# EAGLE design quadcopter (EAGLE 6.5.0)
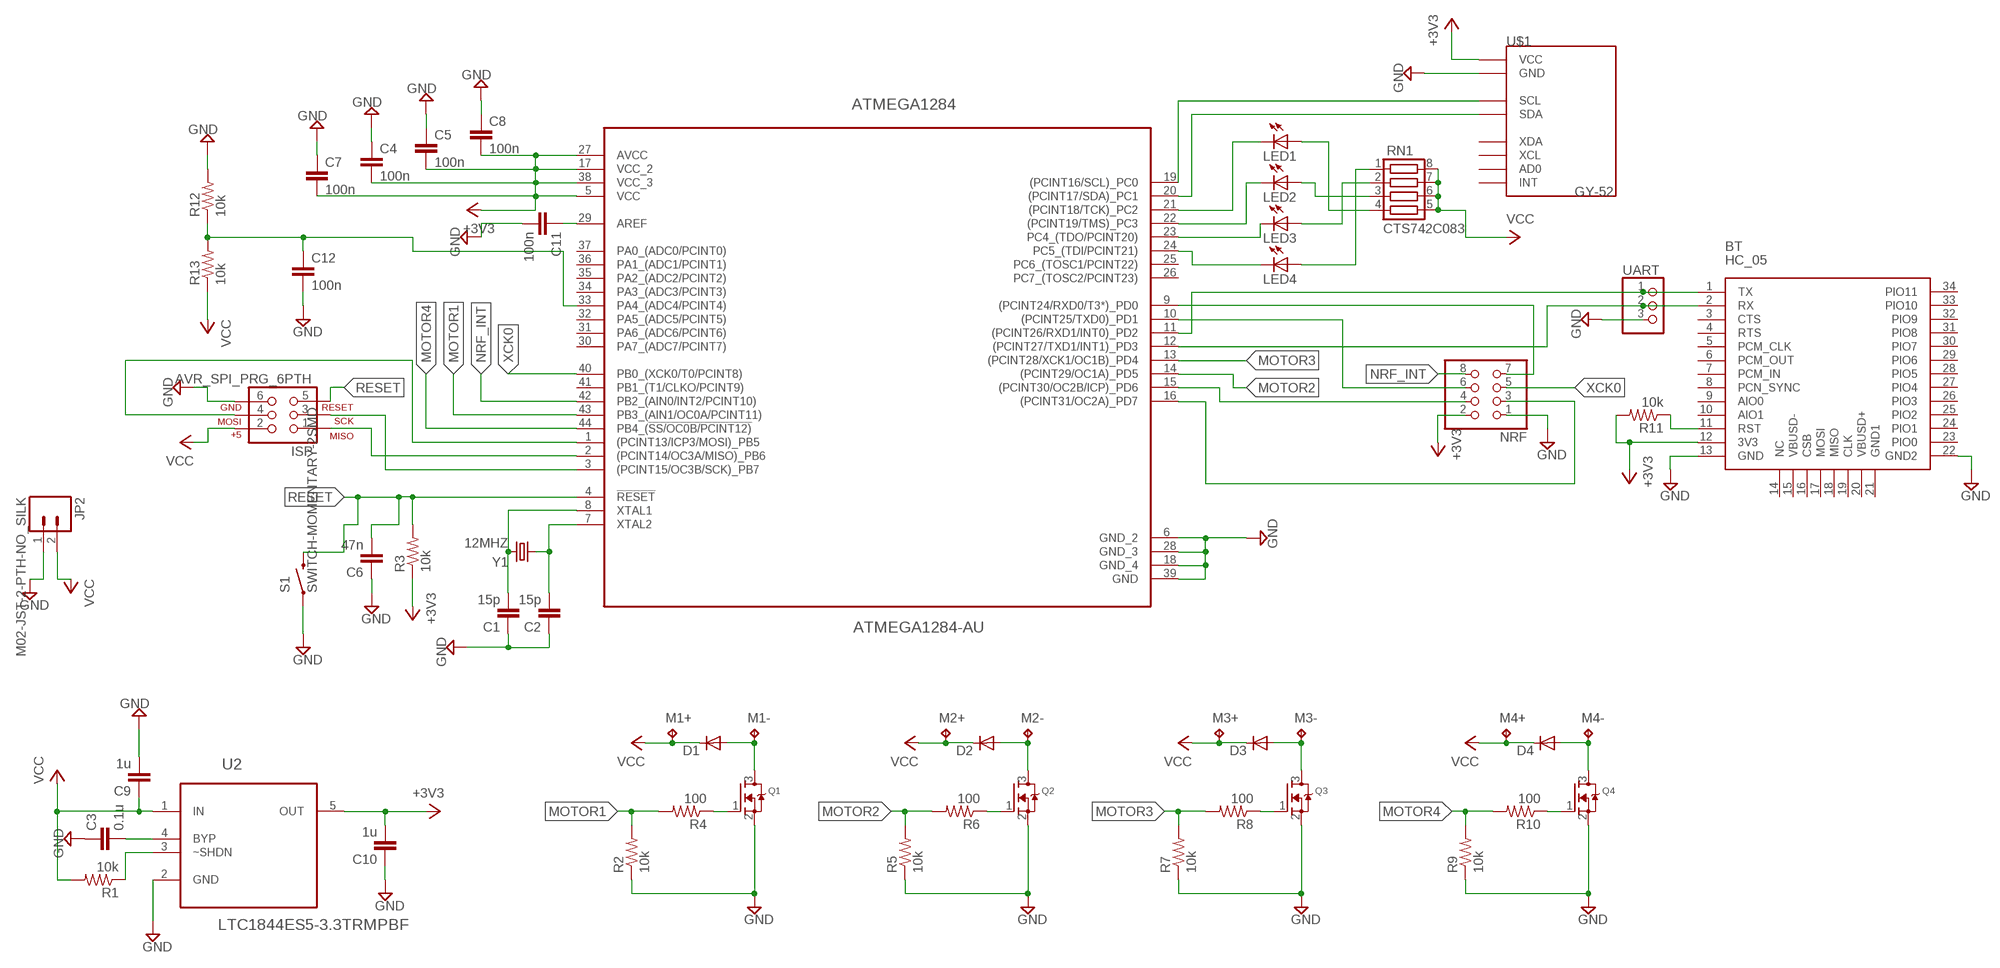
[diagram p0: schematic, sheet 1]

## Parts
ATMEGA1284  ATMEGA1284-AU  [QFP80P1200X1200X120-44N]
BT  HC_05  [BLUETOOTH_SMD]
C1  15p  10UF-6.3V-20%(0603)  [0603-CAP]
C2  15p  10UF-6.3V-20%(0603)  [0603-CAP]
C3  0.1u  10UF-6.3V-20%(0603)  [0603-CAP]
C4  100n  10UF-6.3V-20%(0603)  [0603-CAP]
C5  100n  10UF-6.3V-20%(0603)  [0603-CAP]
C6  47n  10UF-6.3V-20%(0603)  [0603-CAP]
C7  100n  10UF-6.3V-20%(0603)  [0603-CAP]
C8  100n  10UF-6.3V-20%(0603)  [0603-CAP]
C9  1u  10UF-6.3V-20%(0603)  [0603-CAP]
C10  1u  10UF-6.3V-20%(0603)  [0603-CAP]
C11  100n  10UF-6.3V-20%(0603)  [0603-CAP]
C12  100n  10UF-6.3V-20%(0603)  [0603-CAP]
D1  DIODE-SMB  [SMB]
D2  DIODE-SMB  [SMB]
D3  DIODE-SMB  [SMB]
D4  DIODE-SMB  [SMB]
ISP  AVR_SPI_PRG_6PTH  [2X3]
JP2  M02-JST-2-PTH-NO_SILK  [JST-2-PTH-NS]
LED1  LEDCHIP-LED0805  [CHIP-LED0805]
LED2  LEDCHIP-LED0805  [CHIP-LED0805]
LED3  LEDCHIP-LED0805  [CHIP-LED0805]
LED4  LEDCHIP-LED0805  [CHIP-LED0805]
M1+  TPTP20SQ  [TP20SQ]
M1-  TPTP20SQ  [TP20SQ]
M2+  TPTP20SQ  [TP20SQ]
M2-  TPTP20SQ  [TP20SQ]
M3+  TPTP20SQ  [TP20SQ]
M3-  TPTP20SQ  [TP20SQ]
M4+  TPTP20SQ  [TP20SQ]
M4-  TPTP20SQ  [TP20SQ]
NRF  PINHD-2X4  [2X04]
Q1  MOSFET-NREFLOW  [SOT23]
Q2  MOSFET-NREFLOW  [SOT23]
Q3  MOSFET-NREFLOW  [SOT23]
Q4  MOSFET-NREFLOW  [SOT23]
R1  10k  2.0KOHM1/10W5%(0603)  [0603-RES]
R2  10k  2.0KOHM1/10W5%(0603)  [0603-RES]
R3  10k  2.0KOHM1/10W5%(0603)  [0603-RES]
R4  100  2.0KOHM1/10W5%(0603)  [0603-RES]
R5  10k  2.0KOHM1/10W5%(0603)  [0603-RES]
R6  100  2.0KOHM1/10W5%(0603)  [0603-RES]
R7  10k  2.0KOHM1/10W5%(0603)  [0603-RES]
R8  100  2.0KOHM1/10W5%(0603)  [0603-RES]
R9  10k  2.0KOHM1/10W5%(0603)  [0603-RES]
R10  100  2.0KOHM1/10W5%(0603)  [0603-RES]
R11  10k  2.0KOHM1/10W5%(0603)  [0603-RES]
R12  10k  2.0KOHM1/10W5%(0603)  [0603-RES]
R13  10k  2.0KOHM1/10W5%(0603)  [0603-RES]
RN1  CTS742C083  [CTS742C083]
S1  SWITCH-MOMENTARY-2SMD  [TACTILE_SWITCH_SMD]
U2  LTC1844ES5-3.3TRMPBF  [SOT95P280X100-5N]
U$1  GY-52  [PDIP-8]
UART  PINHD-1X3  [1X03]
Y1  12MHZ  CRYSTAL  [TXC-SMD-CRYSTAL]

## Nets
+3V3: ATMEGA1284.5(VCC) ATMEGA1284.17(VCC_2) ATMEGA1284.27(AVCC) ATMEGA1284.38(VCC_3) BT.12(3V3) C4.2 C5.2 C7.2 C8.2 C10.2 NRF.2 R3.1 R11.2 U2.5(OUT) U$1.P$2(VCC)
GND: ATMEGA1284.6(GND_2) ATMEGA1284.18(GND_4) ATMEGA1284.28(GND_3) ATMEGA1284.39(GND) BT.13(GND) BT.22(GND2) C1.1 C2.1 C3.1 C4.1 C5.1 C6.1 C7.1 C8.1 C9.2 C10.1 C11.2 C12.2 ISP.6 JP2.1 NRF.1 Q1.2(S) Q2.2(S) Q3.2(S) Q4.2(S) R2.1 R5.1 R7.1 R9.1 R12.2 S1.1 U2.2(GND) U$1.P$8(GND) UART.3
MOTOR1: ATMEGA1284.43(PB3_(AIN1/OC0A/PCINT11)) R2.2 R4.2
MOTOR2: ATMEGA1284.14((PCINT29/OC1A)_PD5) R5.2 R6.2
MOTOR3: ATMEGA1284.13((PCINT28/XCK1/OC1B)_PD4) R7.2 R8.2
MOTOR4: ATMEGA1284.44(PB4_(!SS/OC0B/PCINT12)) R9.2 R10.2
N$1: ATMEGA1284.8(XTAL1) C1.2 Y1.P$2
N$2: ATMEGA1284.7(XTAL2) C2.2 Y1.P$1
N$3: ATMEGA1284.19((PCINT16/SCL)_PC0) U$1.P$6(SCL)
N$4: ATMEGA1284.1((PCINT13/ICP3/MOSI)_PB5) ISP.4
N$5: ATMEGA1284.2((PCINT14/OC3A/MISO)_PB6) ISP.1
N$6: ATMEGA1284.3((PCINT15/OC3B/SCK)_PB7) ISP.3
N$7: ATMEGA1284.20((PCINT17/SDA)_PC1) U$1.P$7(SDA)
N$8: ATMEGA1284.10((PCINT25/TXD0)_PD1) NRF.6
N$9: R1.1 U2.3(~SHDN)
N$10: C3.2 U2.4(BYP)
N$11: Q2.1(G) R6.1
N$12: Q1.1(G) R4.1
N$13: D2.A M2-.TP Q2.3(D)
N$14: D1.A M1-.TP Q1.3(D)
N$15: ATMEGA1284.11((PCINT26/RXD1/INT0)_PD2) BT.1(TX) UART.1
N$16: Q3.1(G) R8.1
N$17: D3.A M3-.TP Q3.3(D)
N$18: ATMEGA1284.9((PCINT24/RXD0/T3*)_PD0) NRF.7
N$19: Q4.1(G) R10.1
N$20: D4.A M4-.TP Q4.3(D)
N$21: ATMEGA1284.15((PCINT30/OC2B/ICP)_PD6) NRF.4
N$22: ATMEGA1284.16((PCINT31/OC2A)_PD7) NRF.3
N$23: ATMEGA1284.12((PCINT27/TXD1/INT1)_PD3) BT.2(RX) UART.2
N$24: ATMEGA1284.24(PC5_(TDI/PCINT21)) LED4.C
N$25: BT.11(RST) R11.1
N$26: ATMEGA1284.23(PC4_(TDO/PCINT20)) LED3.C
N$27: ATMEGA1284.22((PCINT19/TMS)_PC3) LED2.C
N$28: ATMEGA1284.21((PCINT18/TCK)_PC2) LED1.C
N$29: LED4.A RN1.1
N$30: LED3.A RN1.2
N$31: LED2.A RN1.3
N$32: LED1.A RN1.4
N$33: ATMEGA1284.29(AREF) C11.1
N$34: ATMEGA1284.33(PA4_(ADC4/PCINT4)) C12.1 R12.1 R13.2
NRF_INT: ATMEGA1284.42(PB2_(AIN0/INT2/PCINT10)) NRF.8
RESET: ATMEGA1284.4(!RESET) C6.2 ISP.5 R3.2 S1.3
VCC: C9.1 D1.C D2.C D3.C D4.C ISP.2 JP2.2 M1+.TP M2+.TP M3+.TP M4+.TP R1.2 R13.1 RN1.5 RN1.6 RN1.7 RN1.8 U2.1(IN)
XCK0: ATMEGA1284.40(PB0_(XCK0/T0/PCINT8)) NRF.5
Unconnected: ATMEGA1284.25(PC6_(TOSC1/PCINT22)) ATMEGA1284.26(PC7_(TOSC2/PCINT23)) ATMEGA1284.30(PA7_(ADC7/PCINT7)) ATMEGA1284.31(PA6_(ADC6/PCINT6)) ATMEGA1284.32(PA5_(ADC5/PCINT5)) ATMEGA1284.34(PA3_(ADC3/PCINT3)) ATMEGA1284.35(PA2_(ADC2/PCINT2)) ATMEGA1284.36(PA1_(ADC1/PCINT1)) ATMEGA1284.37(PA0_(ADC0/PCINT0)) ATMEGA1284.41(PB1_(T1/CLKO/PCINT9)) BT.3(CTS) BT.4(RTS) BT.5(PCM_CLK) BT.6(PCM_OUT) BT.7(PCM_IN) BT.8(PCN_SYNC) BT.9(AIO0) BT.10(AIO1) BT.14(NC) BT.15(VBUSD-) BT.16(CSB) BT.17(MOSI) BT.18(MISO) BT.19(CLK) BT.20(VBUSD+) BT.21(GND1) BT.23(PIO0) BT.24(PIO1) BT.25(PIO2) BT.26(PIO3) BT.27(PIO4) BT.28(PIO5) BT.29(PIO6) BT.30(PIO7) BT.31(PIO8) BT.32(PIO9) BT.33(PIO10) BT.34(PIO11) U$1.P$1(XDA) U$1.P$3(XCL) U$1.P$4(AD0) U$1.P$5(INT)

## Library data of the parts
ATMEGA1284 = quad_parts:ATMEGA1284-AU: MCU, 8BIT, AVR, 128K FLASH, TQFP-44; MPN: ATMEGA1284-AU; OC_FARNELL: 1972064; OC_NEWARK: 68T2551; PACKAGE: TQFP-44; SUPPLIER: ATMEL
BT = quad_parts:HC_05: HC-05 Bluetooth Module
C1-C12 = SparkFun-Capacitors:10UF-6.3V-20%(0603): CAP-11015; PROD_ID: CAP-11015; VALUE: 10uF
D1-D4 = diode:DIODE-: DIODE
ISP = SparkFun-Connectors:AVR_SPI_PRG_6: AVR ISP 6 Pin This is the reduced ISP connector for AVR programming. Common on Arduino. This footprint will take up less PCB space and can be used with a 10-pin to 6-pin adapter such as SKU: BOB-08508
JP2 = SparkFun-Connectors:M02: Standard 2-pin 0.1" header. Use with - straight break away headers ( PRT-00116) - right angle break away headers (PRT-00553) - swiss pins (PRT-00743) - machine pins (PRT-00117) - female headers (PRT-00115) Molex polarized connector foot print use with: PRT-08233 with associated crimp pins and housings. 2.54_SCREWTERM for use with PRT-10571. 3.5mm Screw Terminal footprints for PRT-08084 5mm Screw Terminal footprints for use with PRT-08433
LED1-LED4 = led:LED: LED OSRAM: - CHIPLED LG R971, LG N971, LY N971, LG Q971, LY Q971, LO R971, LY R971 LH N974, LH R974 LS Q976, LO Q976, LY Q976 LO Q996 - Hyper CHIPLED LW Q18S LB Q993, LB Q99A, LB R99A - SideLED LS A670, LO A670, LY A670, LG A670, LP A670 LB A673, LV A673, LT A673, LW A673 LH A674 LY A675 LS A676, LA A676, LO A676, LY A676, LW A676 LS A679, LY A679, LG A679 - Hyper Micro SIDELED® LS Y876, LA Y876, LO Y876, LY Y876 LT Y87S - SmartLED LW L88C, LW L88S LB L89C, LB L89S, LG L890 LS L89K, LO L89K, LY L89K LS L896, LA L896, LO L896, LY L896 - TOPLED LS T670, LO T670, LY T670, LG T670, LP T670 LSG T670, LSP T670, LSY T670, LOP T670, LYG T670 LG T671, LOG T671, LSG T671 LB T673, LV T673, LT T673, LW T673 LH T674 LS T676, LA T676, LO T676, LY T676, LB T676, LH T676, LSB T676, LW T676 LB T67C, LV T67C, LT T67C, LS T67K, LO T67K, LY T67K, LW E67C LS E67B, LA E67B, LO E67B, LY E67B, LB E67C, LV E67C, LT E67C LW T67C LS T679, LY T679, LG T679 LS T770, LO T770, LY T770, LG T770, LP T770 LB T773, LV T773, LT T773, LW T773 LH T774 LS E675, LA E675, LY E675, LS T675 LS T776, LA T776, LO T776, LY T776, LB T776 LHGB T686 LT T68C, LB T68C - Hyper Mini TOPLED® LB M676 - Mini TOPLED Santana® LG M470 LS M47K, LO M47K, LY M47K Source: http://www.osram.convergy.de LUXEON: - LUMILED® LXK2-PW12-R00, LXK2-PW12-S00, LXK2-PW14-U00, LXK2-PW14-V00 LXK2-PM12-R00, LXK2-PM12-S00, LXK2-PM14-U00 LXK2-PE12-Q00, LXK2-PE12-R00, LXK2-PE12-S00, LXK2-PE14-T00, LXK2-PE14-U00 LXK2-PB12-K00, LXK2-PB12-L00, LXK2-PB12-M00, LXK2-PB14-N00, LXK2-PB14-P00, LXK2-PB14-Q00 LXK2-PR12-L00, LXK2-PR12-M00, LXK2-PR14-Q00, LXK2-PR14-R00 LXK2-PD12-Q00, LXK2-PD12-R00, LXK2-PD12-S00 LXK2-PH12-R00, LXK2-PH12-S00 LXK2-PL12-P00, LXK2-PL12-Q00, LXK2-PL12-R00 Source: www.luxeon.com KINGBRIGHT: KA-3528ASYC Source: www.kingbright.com
M1+ M1- M2+ M2- M3+ M3- M4+ M4- = testpad:TP: Test pad
NRF = pinhead:PINHD-2X4: PIN HEADER
Q1-Q4 = adafruit:MOSFET-N: N-Channel Mosfet 2N7002E - 60V 260mA SOT23 [Digikey: 2N7002ET1GOSTR-ND] - REEL BSH103 - 30V 850mA SOT23 [Digikey: 568-5013-1-ND]
R1-R13 = SparkFun-Resistors:2.0KOHM1/10W5%(0603): RES-08296; PROD_ID: RES-08296; VALUE: 2.0k
RN1 = resistor-net:CTS742C083: Chip Resistor Array 4 Single Resistor Source: http://www.ctscorp.com/components/Datasheets/CTSChipArrayDs.pdf; OC_FARNELL: unknown; OC_NEWARK: unknown
S1 = SparkFun-Electromechanical:SWITCH-MOMENTARY-2: Various NO switches- pushbuttons, reed, etc
U2 = quad_parts:LTC1844ES5-3.3TRMPBF: 150mA, Micropower, Low Noise, VLDO Linear Regulator; MPN: LTC1844ES5-3.3#TRMPBF; OC_FARNELL: 1663867; OC_NEWARK: 19P0621; PACKAGE: SOT-23-5; SUPPLIER: Linear Technology
U$1 = quad_parts:GY-52
UART = pinhead:PINHD-1X3: PIN HEADER
Y1 = quad_parts:CRYSTAL: CRYSTAL

## Board
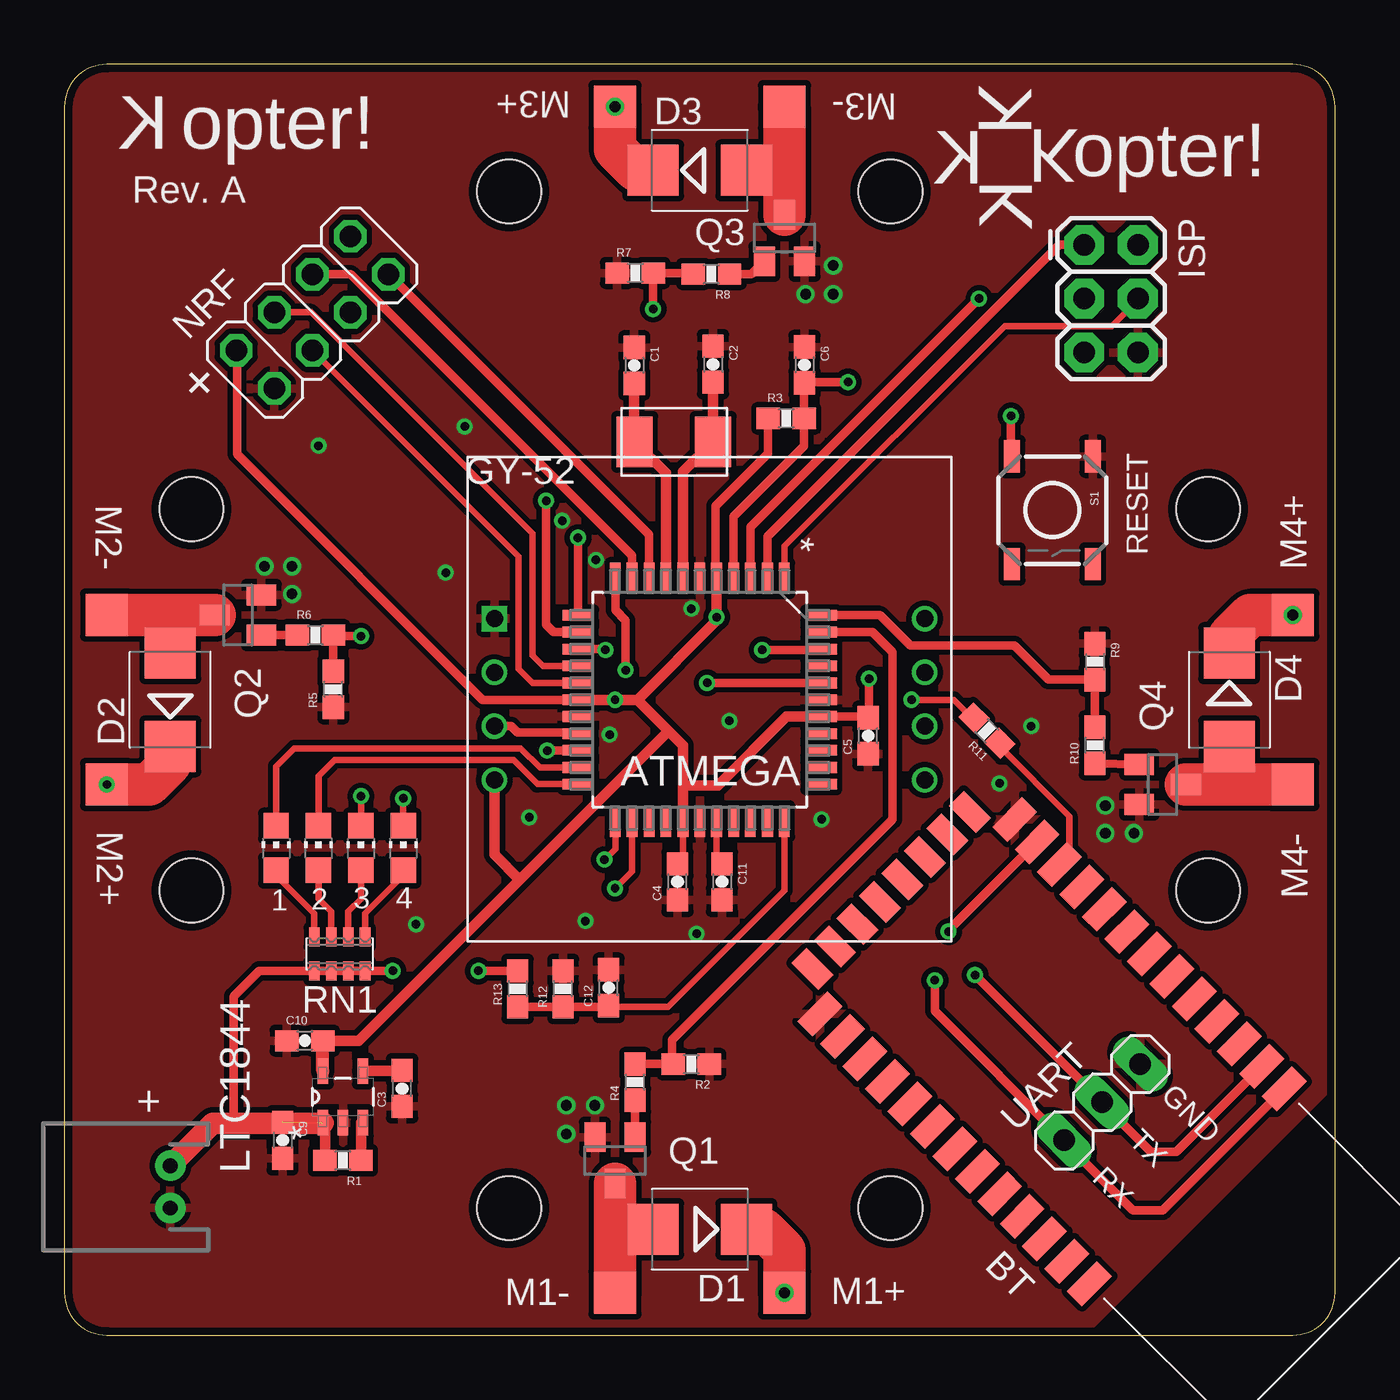
[diagram p1: board, top side]
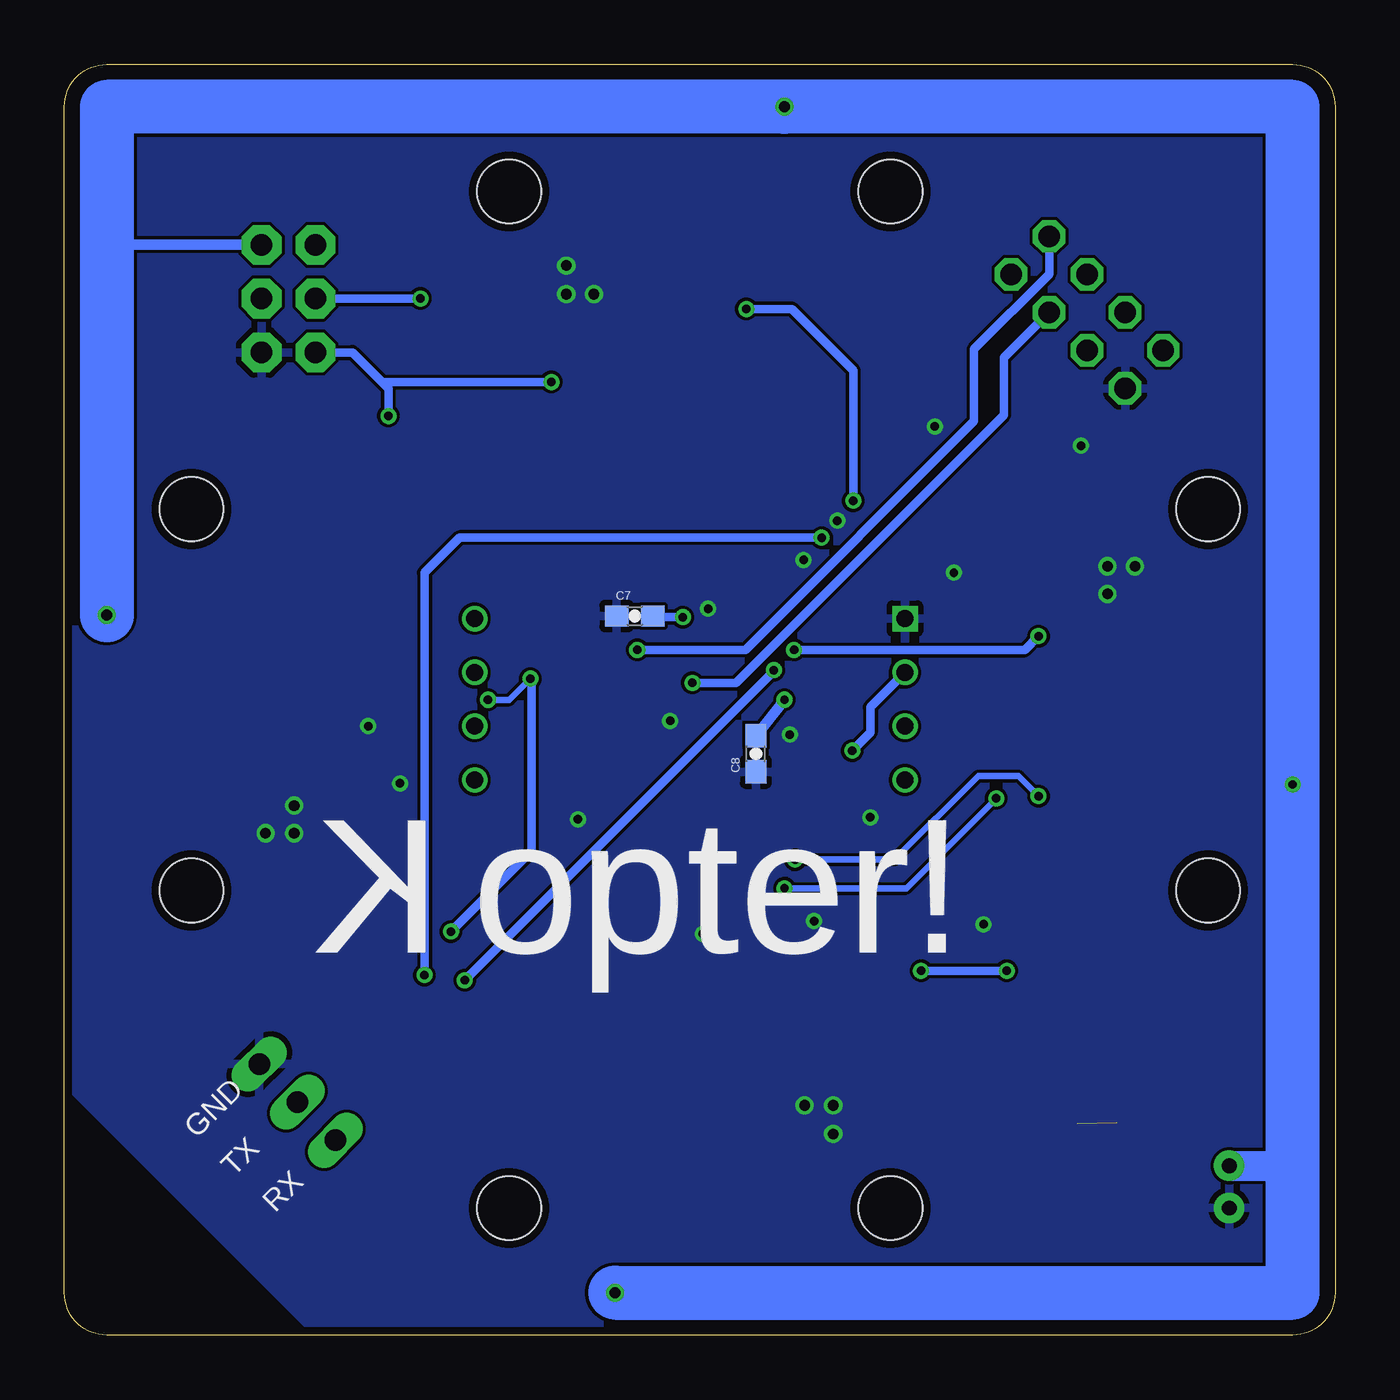
[diagram p2: board, bottom side, seen from below]

Size 60 x 60 mm. Coordinates in mm from the lower left corner, seen from the top.
Outline: 0,58 0,2 arc90 2,0 58,0 arc90 60,2 60,58 arc90 58,60 2,60 arc90 0,58
Copper layers (1*16): Top 0.0356mm / dielectric 1.5011mm / Bottom 0.0356mm
Design rules "OSHPark *": minimum track width 6mil, minimum drill 13mil, track to track 6mil, track to pad 6mil, pad to pad 6mil, via to via 6mil, smd to smd 6mil, copper to edge 15mil, drill to drill 6mil, minimum pad ring 7mil, minimum via ring 7mil, stop-mask expansion 3mil, vias tented up to drill 0.5mm, thermal gap 10mil
Holes 3 mm at 6,39 6,21 21,54 39,54 54,39 54,21 21,6 39,6

### Footprints (pad centres in the part's own frame; a part is rotated, then mirrored left to right if it is on the bottom)
QFP80P1200X1200X120-44N = smd 1.473 x 0.508: 1 -5.74,3.988; 2 -5.74,3.2; 3 -5.74,2.388; 4 -5.74,1.6; 5 -5.74,0.787; 6 -5.74,0; 7 -5.74,-0.787; 8 -5.74,-1.6; 9 -5.74,-2.388; 10 -5.74,-3.2; 11 -5.74,-3.988; 23 5.74,-3.988; 24 5.74,-3.2; 25 5.74,-2.388; 26 5.74,-1.6; 27 5.74,-0.787; 28 5.74,0; 29 5.74,0.787; 30 5.74,1.6; 31 5.74,2.388; 32 5.74,3.2; 33 5.74,3.988 | smd 0.508 x 1.473: 12 -3.988,-5.74; 13 -3.2,-5.74; 14 -2.388,-5.74; 15 -1.6,-5.74; 16 -0.787,-5.74; 17 0,-5.74; 18 0.787,-5.74; 19 1.6,-5.74; 20 2.388,-5.74; 21 3.2,-5.74; 22 3.988,-5.74; 34 3.988,5.74; 35 3.2,5.74; 36 2.388,5.74; 37 1.6,5.74; 38 0.787,5.74; 39 0,5.74; 40 -0.787,5.74; 41 -1.6,5.74; 42 -2.388,5.74; 43 -3.2,5.74; 44 -3.988,5.74
BLUETOOTH_SMD = smd 2 x 1: 1 -6.35,3.81; 2 -6.35,2.31; 3 -6.35,0.81; 4 -6.35,-0.69; 5 -6.35,-2.19; 6 -6.35,-3.69; 7 -6.35,-5.19; 8 -6.35,-6.69; 9 -6.35,-8.19; 10 -6.35,-9.69; 11 -6.35,-11.19; 12 -6.35,-12.69; 13 -6.35,-14.19; 22 6.65,-14.19; 23 6.65,-12.69; 24 6.65,-11.19; 25 6.65,-9.69; 26 6.65,-8.19; 27 6.65,-6.69; 28 6.65,-5.19; 29 6.65,-3.69; 30 6.65,-2.19; 31 6.65,-0.69; 32 6.65,0.81; 33 6.65,2.31; 34 6.65,3.81 | smd 1 x 1.8: 14 -5.1,-15.94; 15 -3.6,-15.94; 16 -2.1,-15.94; 17 -0.6,-15.94; 18 0.9,-15.94; 19 2.4,-15.94; 20 3.9,-15.94; 21 5.4,-15.94
0603-CAP = smd 1.1 x 1: 1 -0.85,0; 2 0.85,0
SMB = smd 2.4 x 2.4: A 2.2,0; C -2.2,0
2X3 = drill 1.016 pad 1.88 octagon: 1 0,0; 2 0,2.54; 3 2.54,0; 4 2.54,2.54; 5 5.08,0; 6 5.08,2.54
JST-2-PTH-NS = drill 0.7 pad 1.448: 1 -1,0; 2 1,0
CHIP-LED0805 = smd 1.2 x 1.2: A 0,-1.05; C 0,1.05
TP20SQ = smd 2 x 2: TP 0,0
2X04 = drill 1.016 octagon: 1 -3.81,-1.27; 2 -3.81,1.27; 3 -1.27,-1.27; 4 -1.27,1.27; 5 1.27,-1.27; 6 1.27,1.27; 7 3.81,-1.27; 8 3.81,1.27
SOT23 = smd 1 x 1.4: 1 -0.95,-1.1; 2 0.95,-1.1; 3 0,1.1
0603-RES = smd 1.1 x 1: 1 -0.85,0; 2 0.85,0
CTS742C083 = smd 0.5 x 0.9: 1 -1.2,-0.8; 2 -0.4,-0.8; 3 0.4,-0.8; 4 1.2,-0.8; 5 1.2,0.8; 6 0.4,0.8; 7 -0.4,0.8; 8 -1.2,0.8
TACTILE_SWITCH_SMD = smd 1.524 x 0.762: 1 -2.54,1.905; 2 2.54,1.905; 3 -2.54,-1.905; 4 2.54,-1.905
SOT95P280X100-5N = smd 1.219 x 0.508: 1 -1.219,0.94; 2 -1.219,0; 3 -1.219,-0.94; 4 1.219,-0.94; 5 1.219,0.94
PDIP-8 = drill 0.8: P$1 -1.27,22.86; P$2 19.05,22.86; P$3 -1.27,20.32; P$4 -1.27,17.78; P$5 -1.27,15.24; P$6 19.05,20.32; P$7 19.05,17.78 | drill 0.8 square: P$8 19.05,15.24
1X03 = drill 1.016 long: 1 -2.54,0; 2 0,0; 3 2.54,0
TXC-SMD-CRYSTAL = smd 1.7 x 2.4: P$1 -1.83,0; P$2 1.87,0

### Placement (x,y rotation side)
ATMEGA1284  30,30 270 top
BT  50.41,9.83 225 top
C1  26.9,45.79 270 top
C2  30.63,45.84 270 top
C3  15.95,11.65 90 top
C4  28.95,21.4 90 top
C5  37.95,28.3 90 top
C6  34.94,45.81 270 top
C7  33.07,33.96 0 bottom
C8  27.35,27.45 90 bottom
C9  10.3,9.2 270 top
C10  11.35,13.9 0 top
C11  31.05,21.4 270 top
C12  25.7,16.4 90 top
D1  30,5 180 top
D2  5,30 90 top
D3  30,55 0 top
D4  55,30 270 top
ISP  48.15,51.48 270 top
JP2  5,7 90 top
LED1  10,23 0 top
LED2  12,23 0 top
LED3  14,23 0 top
LED4  16,23 0 top
M1+  34,2 0 top
M1-  26,2 0 top
M2+  2,26 270 top
M2-  2,34 0 top
M3+  26,58 180 top
M3-  34,58 180 top
M4+  58,34 270 top
M4-  58,26 270 top
NRF  11.71,48.29 45 top
Q1  26,8.25 180 top
Q2  8.2,34 90 top
Q3  34,51.8 0 top
Q4  51.85,26 270 top
R1  13.15,8.25 180 top
R2  29.6,12.8 180 top
R3  34.08,43.29 0 top
R4  26.95,11.95 90 top
R5  12.7,30.5 90 top
R6  11.85,33.05 0 top
R7  26.95,50.15 0 top
R8  30.55,50.1 180 top
R9  48.65,31.8 270 top
R10  48.65,27.85 90 top
R11  43.55,28.54 135 top
R12  23.55,16.35 90 top
R13  21.4,16.35 270 top
RN1  13,18 180 top
S1  46.65,38.95 270 top
U2  13.15,11.25 90 top
U$1  39.35,49.07 180 top
UART  49,11 45 top
Y1  28.8,42.18 180 top

### Tracks (layer width: path | path; a pad name or v marks a point on that pad's centre or on a via)
+3V3  (via drill 0.4)
  Top 0.305: 42.86,29.14 42,30 v40,30 | ATMEGA1284.27 29.21,22.51 C4.2 | ATMEGA1284.38 34.51,29.21 arc45 34,29
  Top 0.4: R3.1 33.23,41.63 30.75,39.15 30.75,35.78 ATMEGA1284.5 | ATMEGA1284.38 37.64,29.21 C5.2 | ATMEGA1284.17 19.75,30 8.15,41.6 8.15,46.46 NRF.2
  Top 0.406: 45.93,23.23 BT.12 41.75,19.11 v41.75,19.05 | v38,31 38,29.2 C5.2 | R11.2 42.86,29.14
  Top 0.5: U2.5 | ATMEGA1284.17 v26,30 27.05,30 | 27.05,30 30.8,33.75 v30.8,33.9 30.8,35.73 ATMEGA1284.5 | ATMEGA1284.27 29.2,25.95 | 29.2,25.95 30.85,25.95 34.1,29.2 35.73,29.2 ATMEGA1284.38 | 27.05,30 28.52,28.52 | 28.52,28.52 29.2,27.85 29.2,25.95 | C10.2 13.9,13.9 21.5,21.5 | 21.5,21.5 28.52,28.52 | U$1.P$2 20.3,22.7 21.5,21.5
  Top 0.61: U2.5 C10.2
  Bottom 0.305: v40,30 39,30 v38,31
  Bottom 0.406: v30.8,33.9 32.22,33.9 C7.2 | v38,31 37.95,30.95 37.95,22.85 v41.75,19.05
  Bottom 0.5: C8.2 v26,30
GND  (via drill 0.4, 0.4 pad 0.4, 0.5)
  other vias: 23.7,9.5 23.7,10.85 25.05,10.85 9.45,36.3 10.75,35 10.75,36.3 35,49.15 36.3,49.15 36.3,50.5 49.15,25 49.15,23.7 50.5,23.7 29.6,34.3 25.75,28.35 18.9,42.9 12,42 18,36 45.65,28.75 44.15,26.05 23.5,38.45 25.1,36.6 35.75,24.35 31.4,29 16.6,19.4 21.95,24.45 29.85,18.95 24.6,19.55
  pour Top (isolate 0.254): -2,62 -2,-2 46,-2 62,14 62,62
  pour Bottom: -1,61 -1,-1 47,-1 61,13 61,61
MOTOR1
  Top 0.4: R4.2 R2.2
  Top 0.406: R2.2 28.7,12.85 28.7,13.95 39.1,24.35 39.1,32.25 38.15,33.2 ATMEGA1284.43
MOTOR2  (via drill 0.4)
  Top 0.4: R5.2 R6.2 12.75,33 v14,33 | ATMEGA1284.14 25.51,32.39 v25.55,32.35
  Bottom 0.4: v25.55,32.35 14.65,32.35 v14,33
MOTOR3  (via drill 0.4, 0.4 pad 0.4)
  Top 0.4: R8.2 29.65,50.15 R7.2 v27.8,48.45
  Top 0.406: ATMEGA1284.13 23.1,33.2 22.75,33.55 v22.75,39.4
  Bottom 0.4: 27.85,48.4 v27.8,48.45
  Bottom 0.406: v22.75,39.4 22.75,45.55 25.65,48.45 v27.8,48.45
MOTOR4
  Top 0.4: R10.2 R9.2 | 42.05,32.55 39.95,32.55 38.5,34 35.75,34 ATMEGA1284.44
  Top 0.406: 42.05,32.55 44.85,32.55 46.45,30.95 R9.2
N$1
  Top 0.5: C1.2 26.91,42.2 Y1.P$2 28.4,40.7 ATMEGA1284.8
N$2
  Top 0.5: C2.2 Y1.P$1 29.21,40.76 ATMEGA1284.7
N$3
  Top 0.4: U$1.P$6 21.1,28.75 21.4,28.45 24.21,28.45 ATMEGA1284.19
N$4
  Top 0.305: ISP.4 50.69,48.89 49.45,47.65 44.4,47.65 34,37.25 34,35.75 ATMEGA1284.1
N$5
  Top 0.4: ISP.1 46.98,51.48 33.2,37.7 ATMEGA1284.2
N$6  (via drill 0.4)
  Top 0.4: ATMEGA1284.3 32.4,35.75 32.4,38.15 v43.19,48.94
  Bottom 0.4: ISP.3 v43.19,48.94
N$7  (via drill 0.4)
  Top 0.4: v22.8,27.6 24.25,27.6 ATMEGA1284.20
  Bottom 0.4: U$1.P$7 21.95,29.65 21.95,28.45 v22.8,27.6
N$8
  Top 0.4: NRF.6 13.51,50.09 26.8,36.8 ATMEGA1284.10
N$9
  Top 0.5: U2.3 14,10.03 R1.1
N$10
  Top 0.5: U2.4 15.95,12.47 C3.2
N$11
  Top 0.4: Q2.1 R6.1
N$12
  Top 0.4: Q1.1 R4.1
N$13
  Top 0.4: D2.A 5,34
  Top 2: M2-.TP 5,34 Q2.3
N$14
  Top 2: Q1.3 26,5 | 26,5 M1-.TP | D1.A 26,5
N$15  (via drill 0.4)
  Top 0.406: ATMEGA1284.11 26.01,34.24 26.5,33.75 v26.5,31.4 | v41.1,16.75 41.1,15.31 UART.1 47.2,9.15 50.45,5.9 51.87,5.9 BT.1
  Bottom 0.406: 26.6,31.4 v26.5,31.4 26.5,31.35 v41.1,16.75
N$16
  Top 0.4: R8.1 32.45,50.1 Q3.1
N$17
  Top 0.4: D3.A 34,55
  Top 2: M3-.TP 34,55 Q3.3
N$18
  Top 0.4: NRF.7 27.6,37.8 27.6,35.75 ATMEGA1284.9
N$19
  Top 0.4: Q4.1 R10.1
N$20
  Top 0.4: D4.A 55,26
  Top 2: M4-.TP 55,26 Q4.3
N$21
  Top 0.305: NRF.4 11.65,48.3 22.1,37.85 22.1,32.1 22.6,31.6 ATMEGA1284.15
  Top 0.4: NRF.4
  Top 0.406: ATMEGA1284.15
N$22
  Top 0.305: ATMEGA1284.16 22.11,30.79 21.45,31.45 21.45,36.75 NRF.3
N$23  (via drill 0.4)
  Top 0.406: ATMEGA1284.12 v24.26,37.64 v24.25,37.65 | v43,17 UART.2 49,10.95 51.3,8.65 52.5,8.65 BT.2
  Bottom 0.406: v24.25,37.65 41.35,37.65 43,36 v43,17
N$24  (via drill 0.4)
  Top 0.305: ATMEGA1284.24 26.8,21.9 v26,21.1 | v16,25.35 LED4.C
  Bottom 0.305: v26,21.1 20.25,21.1 v16,25.35
N$25
  Top 0.305: R11.1 44.16,27.94 44.16,27.79 47.45,24.5 47.45,22.69
  Top 0.406: 47.45,22.69 47.38,22.62 BT.11
N$26  (via drill 0.4)
  Top 0.305: ATMEGA1284.23 26.01,22.96 v25.5,22.45 | v14,25.45 LED3.C
  Bottom 0.305: v25.5,22.45 20.8,22.45 16.85,26.4 14.95,26.4 v14,25.45
N$27
  Top 0.305: ATMEGA1284.22 22.34,26.01 21.2,27.15 12.75,27.15 12,26.4 LED2.C
N$28
  Top 0.305: ATMEGA1284.21 22.45,26.8 21.55,27.7 10.85,27.7 10,26.85 LED1.C
N$29
  Top 0.305: LED4.A 16,21.7 14.2,19.9 RN1.1
N$30
  Top 0.305: LED3.A 14,20.6 13.4,20 RN1.2
N$31
  Top 0.305: LED2.A 12,20.6 12.6,20 RN1.3
N$32
  Top 0.305: LED1.A 10,21.7 11.8,19.9 RN1.4
N$33
  Top 0.305: ATMEGA1284.29 30.79,22.51 C11.1
N$34
  Top 0.305: 34,24.25 34,21 28.5,15.5 25.7,15.5
  Top 0.406: R13.2 R12.1 25.7,15.5 C12.1 | 34,24.25 ATMEGA1284.33
NRF_INT  (via drill 0.4)
  Top 0.406: v32.95,32.35 35.7,32.35 ATMEGA1284.42
  Bottom 0.406: NRF.8 13.5,50.1 17.05,46.55 17.05,43.15 27.85,32.35 v32.95,32.35
RESET  (via drill 0.4)
  Top 0.4: ATMEGA1284.4 31.6,38.65 34.93,41.98 R3.2 C6.2 34.98,45 v37,45
  Top 0.406: S1.3 44.7,41.49 v44.7,43.4
  Bottom 0.4: ISP.5 46.4,46.4 45,45 v37,45
  Bottom 0.406: v44.7,43.4 44.7,44.7 45,45
VCC  (via drill 0.4, 0.5)  (1 unrouted)
  Top 0.305: RN1.6 RN1.5
  Top 0.4: 27,55 D3.C
  Top 0.406: 8,10 8,16 9.2,17.2 RN1.6 RN1.7 RN1.8 v15.5,17.2 | v19.55,17.2 R13.1
  Top 0.5: 12.35,8.25 R1.2 12.3,10.03 U2.1 12.21,10
  Top 1.016: U2.1 12.18,10 8,10 7,10 JP2.2
  Top 2: M3+.TP 26,56 27,55 | M2+.TP 4,26 5,27 D2.C | M1+.TP 34,4 33,5 D1.C | M4+.TP 56,34 55,33 D4.C
  Bottom 0.406: v15.5,17.2 v19.55,17.2
  Bottom 0.5: 57.69,48.31 58,48 | ISP.2 57.52,51.48 58,51
  Bottom 1.422: JP2.2 2,8
  Bottom 2.54: M4+.TP 58,48 58,51 58,58 M3+.TP 2,58 M2+.TP 2,8 2,2 M1+.TP
  other vias: 34,2 2,26 26,58 58,34
XCK0  (via drill 0.4 pad 0.4)
  Top 0.4: ATMEGA1284.40 30.36,30.79 v30.35,30.8
  Bottom 0.4: 15.55,46.25 NRF.5
  Bottom 0.406: v30.35,30.8 28.3,30.8 15.65,43.45 15.65,46.15 15.55,46.25

### Text on the board
tPlace: RESET
tNames: K | K | K | K | opter! | K | opter! | Rev. A | + | ATMEGA | 1 | 2 | 3 | 4 | + | GND | TX | LTC1844 | RX
bNames: opter! | K | GND | TX | RX